# EAGLE schematic indication (EAGLE 9.5.1)
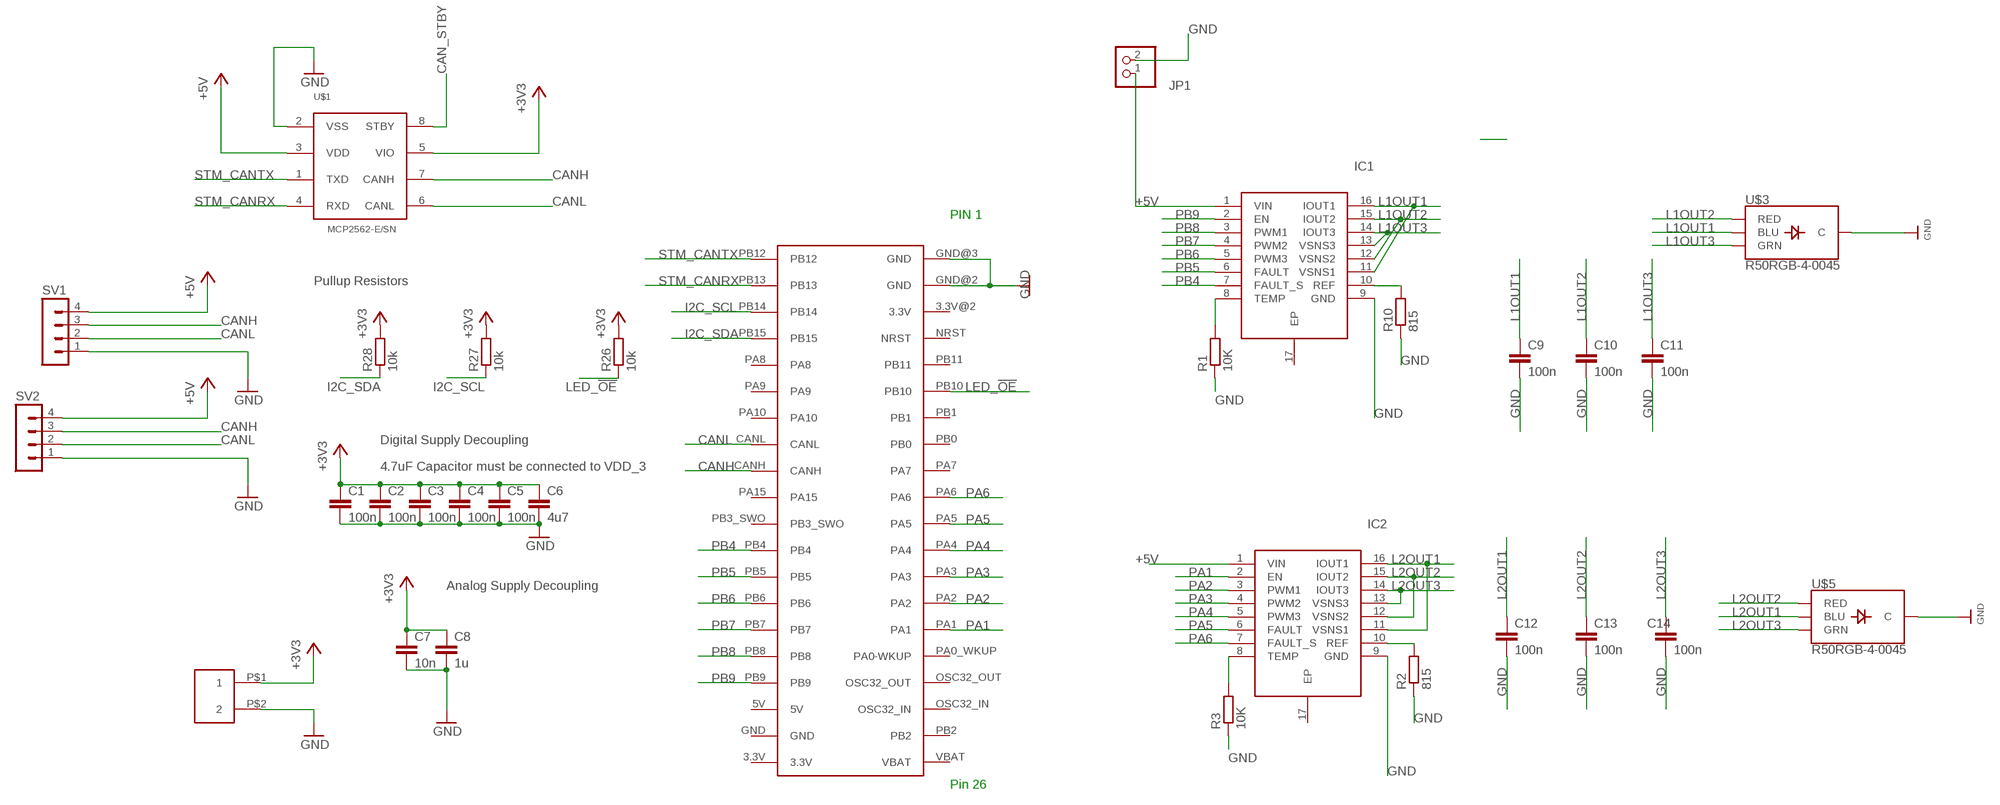
[diagram p0: schematic, sheet 1]

## Parts
C1  100n  C-EUC0805  [C0805]
C2  100n  C-EUC0805  [C0805]
C3  100n  C-EUC0805  [C0805]
C4  100n  C-EUC0805  [C0805]
C5  100n  C-EUC0805  [C0805]
C6  4u7  C-EUC0805  [C0805]
C7  10n  C-EUC0805  [C0805]
C8  1u  C-EUC0805  [C0805]
C9  100n  C-EUC0805  [C0805]
C10  100n  C-EUC0805  [C0805]
C11  100n  C-EUC0805  [C0805]
C12  100n  C-EUC0805  [C0805]
C13  100n  C-EUC0805  [C0805]
C14  100n  C-EUC0805  [C0805]
IC1  TPS92630QPWPRQ1  [SOP65P640X120-17N]
IC2  TPS92630QPWPRQ1  [SOP65P640X120-17N]
JP1  PINHD-1X2  [1X02]
R1  10K  R-EU_R0805  [R0805]
R2  815  R-EU_R0805  [R0805]
R3  10K  R-EU_R0805  [R0805]
R10  815  R-EU_R0805  [R0805]
R26  10k  R-EU_R0805  [R0805]
R27  10k  R-EU_R0805  [R0805]
R28  10k  R-EU_R0805  [R0805]
SV1  MA04-1  [MA04-1]
SV2  MA04-1  [MA04-1]
U$1  MCP2562-E/SN  [SOIC8]
U$2  STM-DEV-BOARD  [STM-DEV-BOARD]
U$3  R50RGB-4-0045  [R50RGB-4-0045]
U$4  TE-CONN_5-103669-1  [TE-CONN_5-103669-1]
U$5  R50RGB-4-0045  [R50RGB-4-0045]

## Nets
+3V3: C1.1 C2.1 C3.1 C4.1 C5.1 C6.1 C7.1 C8.1 R26.2 R27.2 R28.2 U$1.5(VIO) U$4.P$1
+5V: IC1.1(VIN) IC2.1(VIN) JP1.1 SV1.4 SV2.4 U$1.3(VDD)
CAN_STBY: U$1.8(STBY)
CANH: SV1.3 SV2.3 U$1.7(CANH) U$2.CANH
CANL: SV1.2 SV2.2 U$1.6(CANL) U$2.CANL
GND: C1.2 C2.2 C3.2 C4.2 C5.2 C6.2 C7.2 C8.2 C9.2 C10.2 C11.2 C12.2 C13.2 C14.2 IC1.9(GND) IC2.9(GND) JP1.2 R1.1 R2.1 R3.1 R10.1 SV1.1 SV2.1 U$1.2(VSS) U$2.GND@2(GND) U$2.GND@3(GND) U$3.P$2(C) U$4.P$2 U$5.P$2(C)
I2C_SCL: R27.1 U$2.PB14
I2C_SDA: R28.1 U$2.PB15
L1OUT1: C9.1 IC1.11(VSNS1) IC1.16(IOUT1) U$3.P$3(BLU)
L1OUT2: C10.1 IC1.12(VSNS2) IC1.15(IOUT2) U$3.P$4(RED)
L1OUT3: C11.1 IC1.13(VSNS3) IC1.14(IOUT3) U$3.P$1(GRN)
L2OUT1: C12.1 IC2.11(VSNS1) IC2.16(IOUT1) U$5.P$3(BLU)
L2OUT2: C13.1 IC2.12(VSNS2) IC2.15(IOUT2) U$5.P$4(RED)
L2OUT3: C14.1 IC2.13(VSNS3) IC2.14(IOUT3) U$5.P$1(GRN)
LED_!OE: R26.1 U$2.PB10
N$1: IC1.10(REF) R10.2
N$2: IC2.8(TEMP) R3.2
N$3: IC2.10(REF) R2.2
N$12: IC1.8(TEMP) R1.2
PA1: IC2.2(EN) U$2.PA1
PA2: IC2.3(PWM1) U$2.PA2
PA3: IC2.4(PWM2) U$2.PA3
PA4: IC2.5(PWM3) U$2.PA4
PA5: IC2.6(FAULT) U$2.PA5
PA6: IC2.7(FAULT_S) U$2.PA6
PB4: IC1.7(FAULT_S) U$2.PB4
PB5: IC1.6(FAULT) U$2.PB5
PB6: IC1.5(PWM3) U$2.PB6
PB7: IC1.4(PWM2) U$2.PB7
PB8: IC1.3(PWM1) U$2.PB8
PB9: IC1.2(EN) U$2.PB9
STM_CANRX: U$1.4(RXD) U$2.PB13
STM_CANTX: U$1.1(TXD) U$2.PB12
Unconnected: IC1.17(EP) IC2.17(EP) U$2.3.3V U$2.3.3V@2(3.3V) U$2.5V U$2.GND U$2.NRST U$2.OSC32_IN U$2.OSC32_OUT U$2.PA0_WKUP(PA0-WKUP) U$2.PA7 U$2.PA8 U$2.PA9 U$2.PA10 U$2.PA15 U$2.PB0 U$2.PB1 U$2.PB2 U$2.PB3_SWO U$2.PB11 U$2.VBAT

## Notes on the sheet
- PIN 1
- Pullup Resistors
- Digital Supply Decoupling
- 4.7uF Capacitor must be connected to VDD_3
- Analog Supply Decoupling
- Pin 26

## Library data of the parts
C1-C8 = resistor:C-EU: CAPACITOR, European symbol
C9-C14 = rcl:C-EU: CAPACITOR, European symbol; SPICEPREFIX: C
IC1 IC2 = TPS92630QPWPRQ1:TPS92630QPWPRQ1: Automotive Three-Channel Linear LED Driver with Analog and PWM Dimming Source: Datasheet <http://www.ti.com/lit/gpn/tps92630-q1>; DESCRIPTION: Automotive Three-Channel Linear LED Driver with Analog and PWM Dimming; HEIGHT: 1.2mm; MANUFACTURER_NAME: Texas Instruments; MANUFACTURER_PART_NUMBER: TPS92630QPWPRQ1; MOUSER_PART_NUMBER: 595-TPS92630QPWPRQ1; MOUSER_PRICE-STOCK: https://www.mouser.com/Search/Refine.aspx?Keyword=595-TPS92630QPWPRQ1
JP1 = pinhead:PINHD-1X2: PIN HEADER
R1-R3 R10 R26-R28 = resistor:R-EU_: RESISTOR, European symbol
SV1 SV2 = con-lstb:MA04-1: PIN HEADER; OC_FARNELL: unknown; OC_NEWARK: unknown
U$1 = SPEAR:MCP2562-E/SN
U$2 = SPEAR:STM-DEV-BOARD: STM Dev board device for SPEAR custom board
U$3 U$5 = SPEAR-indication:R50RGB-4-0045
U$4 = SPEAR:TE-CONN_5-103669-1